# Altium schematic sheet V1.1.SchDoc
size 762 x 355 mm; SheetTotal: 3
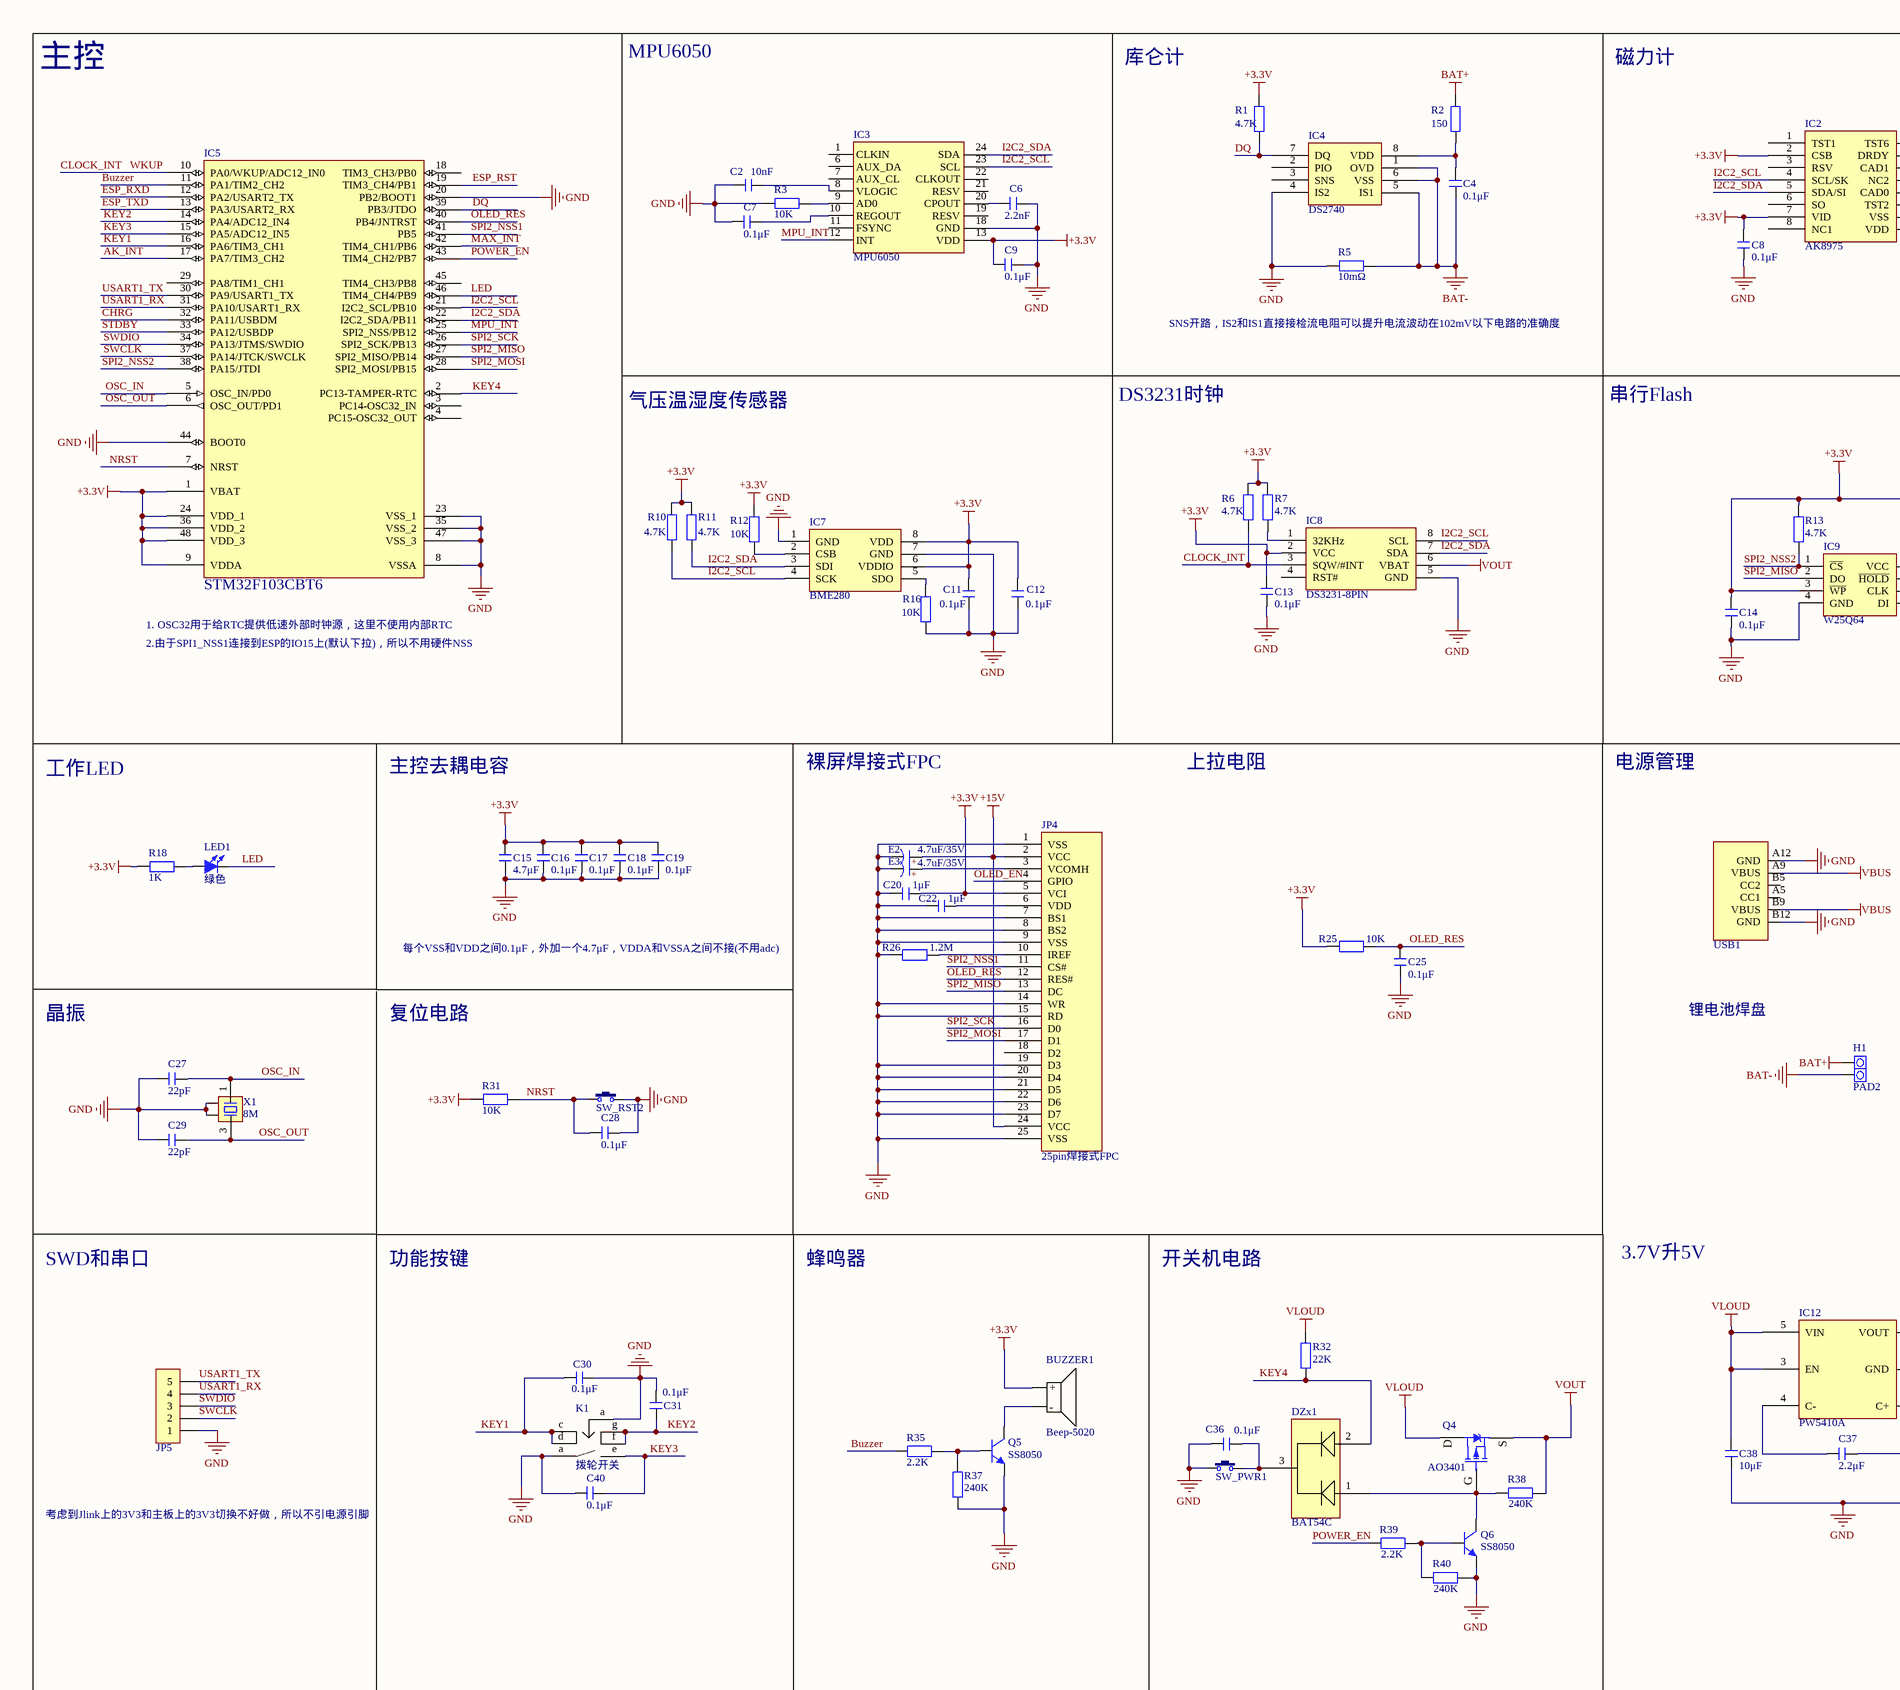
[diagram p0: V1.1.SchDoc, left]
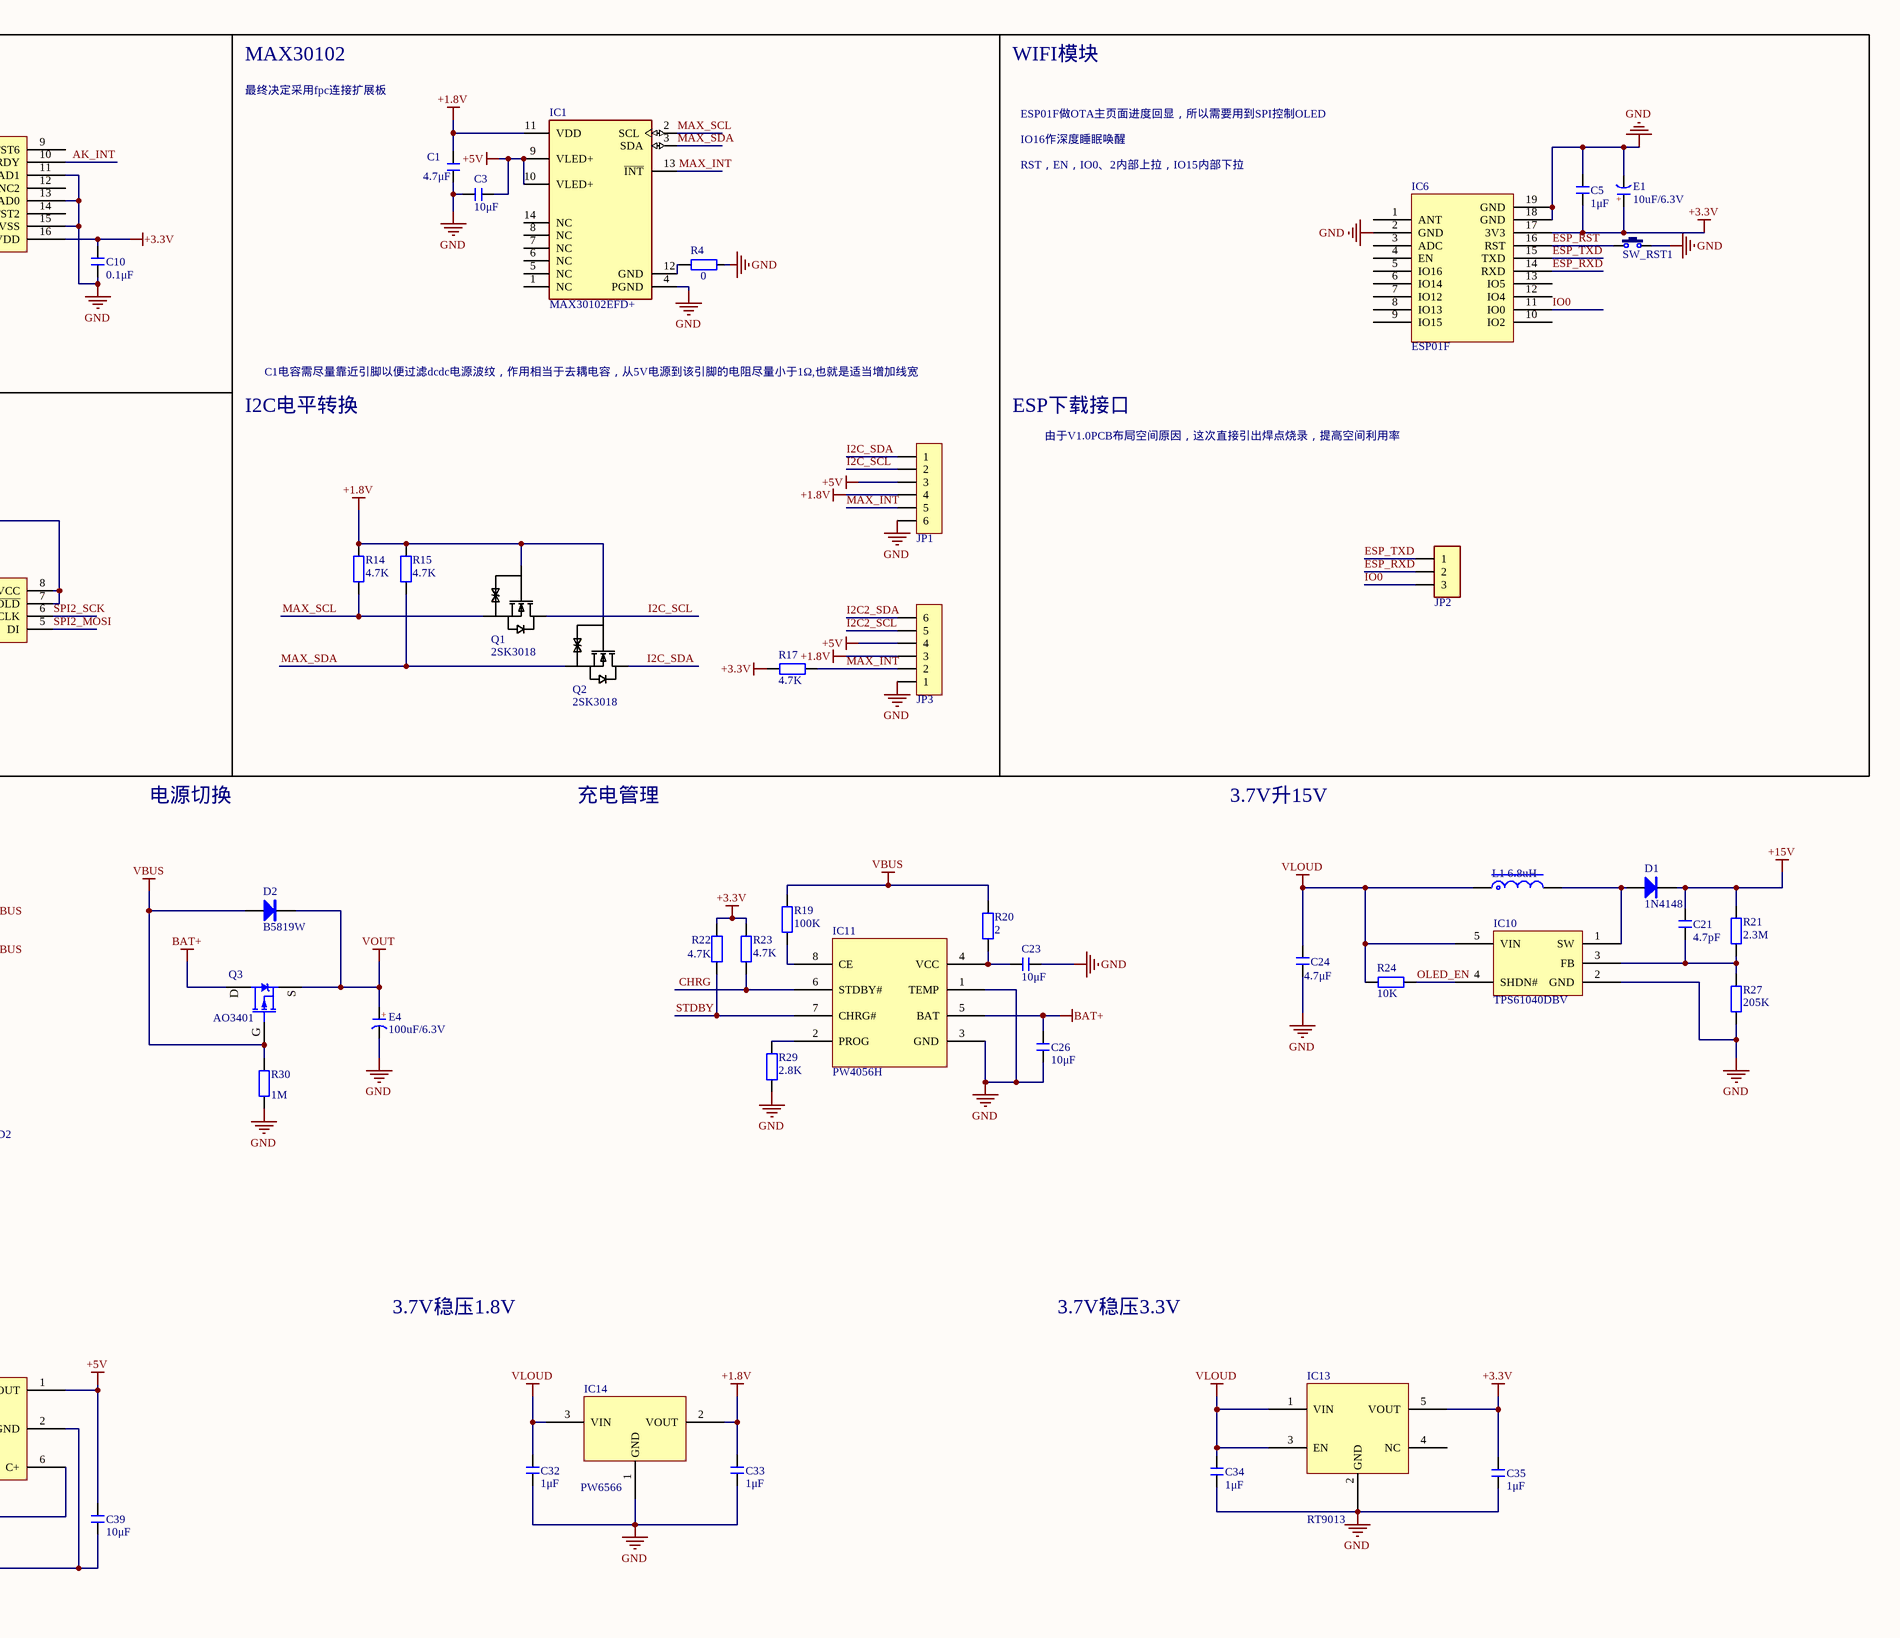
[diagram p1: V1.1.SchDoc, right]

## Parts
BUZZER1  Beep-5020  [5020BUZZER]
C1  4.7μF  [C 0603_L]
C2  10nF  [C 0603_L]
C3  10μF  [C 0603_L]
C4  0.1μF  [C 0603_L]
C5  1μF  [C 0603_L]
C6  2.2nF  [C 0603_L]
C7  0.1μF  [C 0603_L]
C8  0.1μF  [C 0603_L]
C9  0.1μF  [C 0603_L]
C10  0.1μF  [C 0603_L]
C11  0.1μF  [C 0603_L]
C12  0.1μF  [C 0603_L]
C13  0.1μF  [C 0603_L]
C14  0.1μF  [C 0603_L]
C15  4.7μF  [C 0603_L]
C16  0.1μF  [C 0603_L]
C17  0.1μF  [C 0603_L]
C18  0.1μF  [C 0603_L]
C19  0.1μF  [C 0603_L]
C20  1μF  [C 0603_L]
C21  4.7pF  [C 0603_L]
C22  1μF  [C 0603_L]
C23  10μF  [C 0603_L]
C24  4.7μF  [C 0603_L]
C25  0.1μF  [C 0603_L]
C26  10μF  [C 0603_L]
C27  22pF  [C 0603_L]
C28  0.1μF  [C 0603_L]
C29  22pF  [C 0603_L]
C30  0.1μF  [C 0603_L]
C31  0.1μF  [C 0603_L]
C32  1μF  [C 0603_L]
C33  1μF  [C 0603_L]
C34  1μF  [C 0603_L]
C35  1μF  [C 0603_L]
C36  0.1μF  [C 0603_L]
C37  2.2μF  [C 0603_L]
C38  10μF  [C 0603_L]
C39  10μF  [C 0603_L]
C40  0.1μF  [C 0603_L]
D1  1N4148  [SOD-123]
D2  B5819W  [SOD-123]
DZx1  BAT54C  [SOT23-3N]
E1  10uF/6.3V  [CD A(3216)]
E2  4.7uF/35V  [CD A(3216)]
E3  4.7uF/35V  [CD A(3216)]
E4  100uF/6.3V  [CD A(3216)]
H1  PAD2  [CHARGE_PAD]
IC1  MAX30102EFD+  [FP-F143A5-1-MFG]
IC2  AK8975  [QFN16]
IC3  MPU6050  [QFN24 4x4_M]
IC4  DS2740  [MSOP8_L]
IC5  STM32F103CBT6  [LQFP48 7X7_M]
IC6  ESP01F  [ESP-01F]
IC7  BME280  [BME280]
IC8  DS3231-8PIN  [SOP8_N]
IC9  W25Q64  [SOP8W_N]
IC10  TPS61040DBV  [SOT23-5L]
IC11  PW4056H  [SOP-8_L4.9-W3.9-P1.27-LS6.0-BL-EP3.1]
IC12  PW5410A  [SOT23-6]
IC13  RT9013  [SOT23-5L]
IC14  PW6566  [SOT23-3L]
JP1  FPC1.0-6P  [FPC0.5 2H-WS-6P]  (value not drawn)
JP2  HDR-1X3  [TEST_POINT_3]  (value not drawn)
JP3  FPC1.0-6P  [FPC0.5 2H-WS-6P]  (value not drawn)
JP4  25pin焊接式FPC  [25pin焊接式FPC]
JP5  HDR-1X5  [TEST_POINT_5]  (value not drawn)
K1  拨轮开关  [拨轮开关]
L1  6.8uH  [NR3015]
LED1  绿色  [LED 0603G]
Q1  2SK3018  [SOT23-3L]
Q2  2SK3018  [SOT23-3L]
Q3  AO3401  [SOT23-3N]
Q4  AO3401  [SOT23-3N]
Q5  SS8050  [SOT23-3N]
Q6  SS8050  [SOT23-3N]
R1  4.7K  [R 0603_L]
R2  150  [R 0603_L]
R3  10K  [R 0603_L]
R4  0  [R 0603_L]
R5  10mΩ  [R 0603_L]
R6  4.7K  [R 0603_L]
R7  4.7K  [R 0603_L]
R10  4.7K  [R 0603_L]
R11  4.7K  [R 0603_L]
R12  10K  [R 0603_L]
R13  4.7K  [R 0603_L]
R14  4.7K  [R 0603_L]
R15  4.7K  [R 0603_L]
R16  10K  [R 0603_L]
R17  4.7K  [R 0603_L]
R18  1K  [R 0603_L]
R19  100K  [R 0603_L]
R20  2  [R 0603_L]
R21  2.3M  [R 0603_L]
R22  4.7K  [R 0603_L]
R23  4.7K  [R 0603_L]
R24  10K  [R 0603_L]
R25  10K  [R 0603_L]
R26  1.2M  [R 0603_L]
R27  205K  [R 0603_L]
R29  2.8K  [R 0603_L]
R30  1M  [R 0603_L]
R31  10K  [R 0603_L]
R32  22K  [R 0603_L]
R35  2.2K  [R 0603_L]
R37  240K  [R 0603_L]
R38  240K  [R 0603_L]
R39  2.2K  [R 0603_L]
R40  240K  [R 0603_L]
SW_PWR1  3  [KEY-SMD_UK-B0264-SP25Y]  (value not drawn)
SW_RST1  3x4x2  [SW-SMD_L4.0-W3.0-LS4.6]  (value not drawn)
SW_RST2  3x4x2  [SW-SMD_L4.0-W3.0-LS4.6]  (value not drawn)
USB1  918-418K2023S40006  [USB-C-SMD_918-418K2023S40006]  (value not drawn)
X1  8M  [OSC 3225-4P]

## Blocks framed on the sheet
主控: IC5

## Nets
+1.8V: C1.1 C33.1 IC1.11(VDD) IC14.2(VOUT) JP1.4 JP3.3 Q1.1(G) Q2.1(G) R14.1 R15.1
+3.3V: BUZZER1.1(+) C5.1 C8.2 C9.2 C10.2 C11.1 C12.1 C13.1 C14.2 C15.2 C16.2 C17.2 C18.2 C19.2 C20.2 C35.1 E1.1(A) IC2.2(CSB) IC2.7(VID) IC2.16(VDD) IC3.13(VDD) IC5.1(VBAT) IC5.9(VDDA) IC5.24(VDD_1) IC5.36(VDD_2) IC5.48(VDD_3) IC6.17(3V3) IC7.6(VDDIO) IC7.8(VDD) IC8.2(VCC) IC9.3(~{WP}) IC9.7(~{HOLD}) IC9.8(VCC) IC13.5(VOUT) JP4.5(VCI) R1.2 R6.1 R7.1 R10.1 R11.1 R12.2 R13.2 R17.2 R18.2 R22.2 R23.2 R25.1 R31.2
+5V: C3.2 C39.1 IC1.9(VLED+) IC1.10(VLED+) IC12.1(VOUT) JP1.3 JP3.4
+15V: C21.2 D1.2(K) E2.1(A) JP4.2(VCC) JP4.24(VCC) R21.2
BAT+: C26.1 H1.+ IC11.5(BAT) Q3.3(D) R2.2
BAT-: C4.1 H1.- IC4.1(OVD) IC4.5(IS1) IC4.6(VSS) R5.1
GND: C1.2 C2.2 C3.1 C5.2 C6.1 C7.2 C8.1 C9.1 C10.1 C11.2 C12.2 C13.2 C14.1 C15.1 C16.1 C17.1 C18.1 C19.1 C20.1 C22.1 C23.1 C24.1 C25.1 C26.2 C27.2 C28.1 C29.2 C30.2 C31.2 C32.2 C33.2 C34.2 C35.2 C36.1 C38.1 C39.2 C40.2 E1.2(K) E2.2(K) E3.2(K) E4.2(K) IC1.4(PGND) IC2.11(CAD1) IC2.13(CAD0) IC2.15(VSS) IC3.18(GND) IC4.4(IS2) IC5.8(VSSA) IC5.20(PB2/BOOT1) IC5.23(VSS_1) IC5.35(VSS_2) IC5.44(BOOT0) IC5.47(VSS_3) IC6.2(GND) IC6.18(GND) IC6.19(GND) IC7.1(GND) IC7.7(GND) IC8.5(GND) IC9.4(GND) IC10.2(GND) IC11.1(TEMP) IC11.3(GND) IC12.2(GND) IC13.2(GND) IC14.1(GND) JP1.6 JP3.1 JP4.1(VSS) JP4.7(BS1) JP4.8(BS2) JP4.9(VSS) JP4.14(WR) JP4.15(RD) JP4.19(D3) JP4.20(D4) JP4.21(D5) JP4.22(D6) JP4.23(D7) JP4.25(VSS) JP5.1 K1.a Q5.2(E) Q6.2(E) R3.2 R4.1 R5.2 R16.1 R26.1 R27.1 R29.1 R30.2 R37.1 R40.1 SW_PWR1.2 SW_RST1.2 SW_RST2.2 USB1.A12(GND) USB1.B12(GND) X1.2 X1.4
VBUS: D2.1(A) Q3.1(G) R19.2 R20.2 R30.1 USB1.A9(VBUS) USB1.B9(VBUS)
VLOUD: C24.2 C32.1 C34.1 C38.2 IC10.5(VIN) IC12.3(EN) IC12.5(VIN) IC13.1(VIN) IC13.3(EN) IC14.3(VIN) L1.1 Q4.3(D) R24.2 R32.1
VOUT: D2.2(K) E4.1(A) IC8.6(VBAT) Q3.2(S) Q4.2(S) R38.1
AK_INT: IC2.10(DRDY) IC5.17(PA7/TIM3_CH2)
Buzzer: IC5.11(PA1/TIM2_CH2) R35.1
CHRG: IC5.32(PA11/USBDM) IC11.6(STDBY#) R23.1
CLOCK_INT: IC5.10(PA0/WKUP/ADC12_IN0) IC8.3(SQW/#INT) R6.2  [also labelled WKUP]
DQ: IC4.7(DQ) IC5.39(PB3/JTDO) R1.1
ESP_RST: IC5.19(TIM3_CH4/PB1) IC6.16(RST) SW_RST1.1
ESP_RXD: IC5.12(PA2/USART2_TX) IC6.14(RXD) JP2.2
ESP_TXD: IC5.13(PA3/USART2_RX) IC6.15(TXD) JP2.1
I2C2_SCL: IC2.4(SCL/SK) IC3.23(SCL) IC5.21(I2C2_SCL/PB10) IC7.4(SCK) IC8.8(SCL) JP3.5 R10.2
I2C2_SDA: IC2.5(SDA/SI) IC3.24(SDA) IC5.22(I2C2_SDA/PB11) IC7.3(SDI) IC8.7(SDA) JP3.6 R11.2
I2C_SCL: JP1.2 Q1.3(D)
I2C_SDA: JP1.1 Q2.3(D)
IO0: IC6.11(IO0) JP2.3
KEY1: C30.1 IC5.16(PA6/TIM3_CH1) K1.c K1.d
KEY2: C31.1 IC5.14(PA4/ADC12_IN4) K1.f K1.g
KEY3: C40.1 IC5.15(PA5/ADC12_IN5) K1.e
KEY4: DZx1.2 IC5.2(PC13-TAMPER-RTC) R32.2
LED: IC5.46(TIM4_CH4/PB9) LED1.2(K)
MAX_INT: IC1.13(~{INT}) IC5.42(TIM4_CH1/PB6) JP1.5 JP3.2 R17.1
MAX_SCL: IC1.2(SCL) Q1.2(S) R14.2
MAX_SDA: IC1.3(SDA) Q2.2(S) R15.2
MPU_INT: IC3.12(INT) IC5.25(SPI2_NSS/PB12)
NRST: C28.2 IC5.7(NRST) R31.1 SW_RST2.1
OLED_EN: IC10.4(SHDN#) JP4.4(GPIO) R24.1
OLED_RES: C25.2 IC5.40(PB4/JNTRST) JP4.12(RES#) R25.2
OSC_IN: C27.1 IC5.5(OSC_IN/PD0) X1.1
OSC_OUT: C29.1 IC5.6(OSC_OUT/PD1) X1.3
POWER_EN: IC5.43(TIM4_CH2/PB7) R39.2
SPI2_MISO: IC5.27(SPI2_MISO/PB14) IC9.2(DO) JP4.13(DC)
SPI2_MOSI: IC5.28(SPI2_MOSI/PB15) IC9.5(DI) JP4.17(D1)
SPI2_NSS1: IC5.41(PB5) JP4.11(CS#)
SPI2_NSS2: IC5.38(PA15/JTDI) IC9.1(~{CS}) R13.1
SPI2_SCK: IC5.26(SPI2_SCK/PB13) IC9.6(CLK) JP4.16(D0)
STDBY: IC5.33(PA12/USBDP) IC11.7(CHRG#) R22.1
SWCLK: IC5.37(PA14/JTCK/SWCLK) JP5.2
SWDIO: IC5.34(PA13/JTMS/SWDIO) JP5.3
USART1_RX: IC5.31(PA10/USART1_RX) JP5.4
USART1_TX: IC5.30(PA9/USART1_TX) JP5.5
NetBUZZER1_2: BUZZER1.2(-) Q5.3(C)
NetC2_1: C2.1 IC3.8(VLOGIC)
NetC4_2: C4.2 IC4.8(VDD) R2.1
NetC6_2: C6.2 IC3.20(CPOUT)
NetC7_1: C7.1 IC3.10(REGOUT)
NetC21_1: C21.1 IC10.3(FB) R21.1 R27.2
NetC22_2: C22.2 JP4.6(VDD)
NetC23_2: C23.2 IC11.4(VCC) R20.1
NetC36_2: C36.2 DZx1.3 SW_PWR1.1
NetC37_1: C37.1 IC12.6(C+)
NetC37_2: C37.2 IC12.4(C-)
NetD1_1: D1.1(A) IC10.1(SW) L1.2
NetDZx1_1: DZx1.1 Q4.1(G) Q6.3(C) R38.2
NetE3_1: E3.1(A) JP4.3(VCOMH)
NetIC1_12: IC1.12(GND) R4.2
NetIC3_9: IC3.9(AD0) R3.1
NetIC7_2: IC7.2(CSB) R12.1
NetIC7_5: IC7.5(SDO) R16.2
NetIC8_1: IC8.1(32KHz) R7.2
NetIC11_2: IC11.2(PROG) R29.2
NetIC11_8: IC11.8(CE) R19.1
NetJP4_10: JP4.10(IREF) R26.2
NetLED1_1: LED1.1(A) R18.1
NetQ5_1: Q5.1(B) R35.2 R37.2
NetQ6_1: Q6.1(B) R39.1 R40.2

Not connected (* = marked no-connect by the designer): IC1 1(NC) 5(NC) 6(NC) 7(NC) 8(NC) 14(NC); IC2 1(TST1) 3(RSV) 6(SO) 8(NC1) 9(TST6) 12(NC2) 14(TST2); IC3 1(CLKIN) 6(AUX_DA) 7(AUX_CL) 11(FSYNC) 19(RESV) 21(RESV) 22(CLKOUT); IC4 2(PIO) 3(SNS); IC5 3(PC14-OSC32_IN) 4(PC15-OSC32_OUT) 18(TIM3_CH3/PB0) 29(PA8/TIM1_CH1) 45(TIM4_CH3/PB8); IC6 1(ANT) 3(ADC) 4(EN) 5(IO16) 6(IO14) 7(IO12) 8(IO13) 9(IO15) 10(IO2) 12(IO4) 13(IO5); IC8 4(RST#); IC13 4(NC); JP4 18(D2); USB1 A5(CC1) B5(CC2)

## Notes on the sheet
- MPU6050
- 库仑计
- 磁力计
- MAX30102
- 最终决定采用fpc连接扩展板
- WIFI模块
- IO16作深度睡眠唤醒
- ESP01F做OTA主页面进度回显，所以需要用到SPI控制OLED
- RST，EN，IO0、2内部上拉，IO15内部下拉
- SNS开路，IS2和IS1直接接检流电阻可以提升电流波动在102mV以下电路的准确度
- DS3231时钟
- 串行Flash
- I2C电平转换
- C1电容需尽量靠近引脚以便过滤dcdc电源波纹，作用相当于去耦电容，从5V电源到该引脚的电阻尽量小于1Ω,也就是适当增加线宽
- ESP下载接口
- 气压温湿度传感器
- 由于V1.0PCB布局空间原因，这次直接引出焊点烧录，提高空间利用率
- 1. OSC32用于给RTC提供低速外部时钟源，这里不使用内部RTC
- 2.由于SPI1_NSS1连接到ESP的IO15上(默认下拉)，所以不用硬件NSS
- 裸屏焊接式FPC
- 上拉电阻
- 电源管理
- 电源切换
- 充电管理
- 3.7V升15V
- 工作LED
- 主控去耦电容
- 每个VSS和VDD之间0.1μF，外加一个4.7μF，VDDA和VSSA之间不接(不用adc)
- 锂电池焊盘
- 晶振
- 复位电路
- 3.7V升5V
- 3.7V稳压1.8V
- 3.7V稳压3.3V
- SWD和串口
- 功能按键
- 蜂鸣器
- 开关机电路
- 考虑到Jlink上的3V3和主板上的3V3切换不好做，所以不引电源引脚
- (in symbol C-CD) +

## Library data of the parts
BUZZER1 = Beep-5020: 贴片蜂鸣器5020最小封装
C1-C40 = C: 无极性贴片电容; 版权归属: 源创客; BOM名称: 无极性贴片电容; 学习资源: www.ooocke.com
D1 = 1N4148: 高速开关二极管; 版权归属: 源创客; BOM名称: 高速开关二极管; 学习资源: www.ooocke.com
D2 = B5819W: 肖特基二极管; BOM名称: 高速开关二极管; 版权归属: 源创客; 学习资源: www.ooocke.com
DZx1 = BAT54C: 双肖特基，共阴极
E1-E4 = C-CD: 贴片钽电容; 版权归属: 源创客; BOM名称: 贴片钽电容; 学习资源: www.ooocke.com
H1 = PAD2: 引线焊盘; 版权归属: 源创客; BOM名称: 引线焊盘; 学习资源: www.ooocke.com
IC1 = MAX30102: IC SENSOR OXIMETER/HEARTRATE; Manufacturer: Maxim Integrated; Max Junction Temp: +90°C; Min Supply Voltage: 1.7V; Sensor Output: I2C; Operating Supply Current: 600uA; Max Supply Voltage: 2V; Package: F143A5-1; Manufacturer Part Number: MAX30102EFD+; Footprint Url: https://pdfserv.maximintegrated.com/land_patterns/90-0602.PDF; ComponentLink2URL: https://datasheets.maximintegrated.com/en/ds/MAX30102.pdf; Temperature: -40°C to +85°C; Device Class L2: unset; Mouser Description: Pulse Oximeter/Heart Rate Sensor, Oesip; Temperature Range High: +85°C; Automotive: No; Height: 1.65mm; Digikey Description: IC SENSOR OXIMETER/HEARTRATE; Category: IC; Lead Free: Yes; RoHS: TRUE; Temperature Range Low: -40°C; ComponentLink2Description: Datasheet; Octopart: https://octopart.com/max30102efd%2B-maxim+integrated-59568799; Device Class L3: unset; Device Class L1: Sensors
IC2 = AK8975: 采用高灵敏度霍尔传感器技术的三轴电子罗盘IC。 / 最适合步行城市导航，用于手机和其他便携式设备
IC3 = MPU6050: 陀螺仪
IC4 = DS2740: 高精度库仑计
IC5 = STM32F103CB: Flash:128/RAM:20/IO:48; BOM名称: 32位STM单片机; 版权归属: 源创客; 学习资源: www.ooocke.com
IC6 = ESP01F: ESP-01F WiFi 模块是由安信可科技开发的，该模块核心处理器 ESP8285 在较小尺寸封装中集成了业界领先的 Tensilica L106 超低功耗 32 位微型 MCU，带有 16 位精简模式，主频支持 80 MHz 和 160 MH，支持 RTOS，集成 Wi-Fi MAC/BB/RF/PA/LNA。ESP-01F WiFi 模块支持标准的 IEEE802.11 b/g/n 协议，完整的 TCP/IP 协议栈。用户可以使用该模块为现有的设备添加联网功能，也可以构建独立的网络控制器
IC7 = BME280: 气压，湿度，温度传感器
IC9 = W25Qxx: 外置Flash; 版权归属: 源创客; BOM名称: 外置Flash; 学习资源: www.ooocke.com
IC10 = TPS61040DBV: 28V、400mA 开关升压转换器，适用于 LCD 和白光 LED
IC11 = PW4056H: PW4056H 是一款完整的采用恒定电流/恒定电压的高压、大电流、单节鲤离子电池线性充电IC，最高耐压可达 28V，6.5V 自动过压保护，充电电流可达 1A。
IC12 = PW5410A: 低噪声，恒频 1.2MHZ，输入电压范围2.7v-5v，5v固定输出电压，输出电流250mA的DCDC升压
IC13 = RT9013: RT9013是一款超低噪声、超低压差、超快速响应稳压器。它采用SOT23-5 (2.7mm X 1.4mm)/SC70-5( 1 8mm X 1.15mm )/DFN-6L( 2mm X 2mm )三种封装
IC14 = PW6566: PW6566 系列是使用 CMOS 技术开发的低压差，高精度 输出电压，低消耗电流正电压型电压稳压器
JP1 JP3 = FPC-6P: FPC连接器; 版权归属: 源创客; BOM名称: FPC连接器; 学习资源: www.ooocke.com
JP2 = Header 3: 3P接插件; 版权归属: 源创客; BOM名称: 3P接插件; 学习资源: www.ooocke.com
JP5 = Header 5: 5P接插件; 版权归属: 源创客; BOM名称: 5P接插件; 学习资源: www.ooocke.com
L1 = L-NR: NR磁胶电感; 版权归属: 源创客; BOM名称: NR磁胶电感; 学习资源: www.ooocke.com
LED1 = LED-SMD: 贴片LED; 版权归属: 源创客; BOM名称: 贴片LED; 学习资源: www.ooocke.com
Q1 Q2 = 2SK3018: 类型:-;漏源电压(Vdss):-;连续漏极电流(Id):-;功率(Pd):-;导通电阻(RDS(on)@Vgs,Id):-;阈值电压(Vgs(th)@Id):-;栅极电荷(Qg@Vgs):-;输入电容(Ciss@Vds):-;反向传输电容(Crss@Vds):-;; Manufacturer: TWGMC(台湾迪嘉); Symbol: 2SK3018_C727148; Add into BOM: yes; Device: 2SK3018; LCSC Part Name: 2SK3018; Supplier Part: C727148; Manufacturer Part: 2SK3018; Supplier Footprint: SOT-23; JLCPCB Part Class: Extended Part; Datasheet: https://atta.szlcsc.com/upload/public/pdf/source/20200827/C727148_2301BBDB89FCE642A4A39ABEF7075607.pdf; Supplier: LCSC; Convert to PCB: yes; Type: -; Drain Source Voltage (Vdss): -; Continuous Drain Current (Id): -; Power Dissipation (Pd): -; Drain Source On Resistance (RDS(on)@Vgs,Id): -; Gate Threshold Voltage (Vgs(th)@Id): -; Total Gate Charge (Qg@Vgs): -; Input Capacitance (Ciss@Vds): -; Reverse Transfer Capacitance (Crss@Vds): -
Q3 Q4 = AO3401: P沟道场效应管; 版权归属: 源创客; BOM名称: P沟道场效应管; 学习资源: www.ooocke.com
Q5 Q6 = 8050-SMD: 高频放大-NPN型; 版权归属: 源创客; 属性: 40V 1.5A 1W 100MHZ; BOM名称: 高频放大-NPN型; 学习资源: www.ooocke.com
R1-R7 R10-R27 R29-R32 R35 R37-R40 = R: 贴片电阻; 版权归属: 源创客; BOM名称: 贴片电阻; 学习资源: www.ooocke.com
SW_PWR1 = TSW 2x4x3.5: 2x4x3.5轻触开关; 版权归属: 源创客; BOM名称: 2x4x3.5轻触开关; 学习资源: www.ooocke.com
SW_RST1 SW_RST2 = TSW 3x4x2: 3x4x2开关; 版权归属: 源创客; BOM名称: 3x4x2开关; 学习资源: www.ooocke.com
USB1 = TYPE-C 6PIN: 连接器类型:Type-C;标准:USB 3.1;公母:母座;触点数量:6;端口数量:1;安装方式:卧贴;额定电流 - 电源:-;工作温度范围:-40℃~+85℃;; Manufacturer: 精拓金; Add into BOM: yes; Connector Type: Type-C; Gender: 母座; Number of Contacts: 6; Number of Ports: 1; Symbol: 918-418K2023S40006; Device: 918-418K2023S40006; LCSC Part Name: Type-C 母座 卧贴 无弹单排LCP黑胶; Supplier Part: C399925; Manufacturer Part: 918-418K2023S40006; Supplier Footprint: SMD; JLCPCB Part Class: Extended Part; Datasheet: https://atta.szlcsc.com/upload/public/pdf/source/20190620/C399925_D8B78B8101E8027AE7B71A8976357F30.pdf; Supplier: LCSC; Convert to PCB: yes; Standard: USB 3.1; Mounting Style: 卧贴; Current Rating - Power (Max): -; Operating Temperature Range: -40℃~+85℃
X1 = XTAL-4P: 4脚无源晶振; 版权归属: 源创客; BOM名称: 4脚无源晶振; 学习资源: www.ooocke.com